# Altium project Camera.PrjPcb
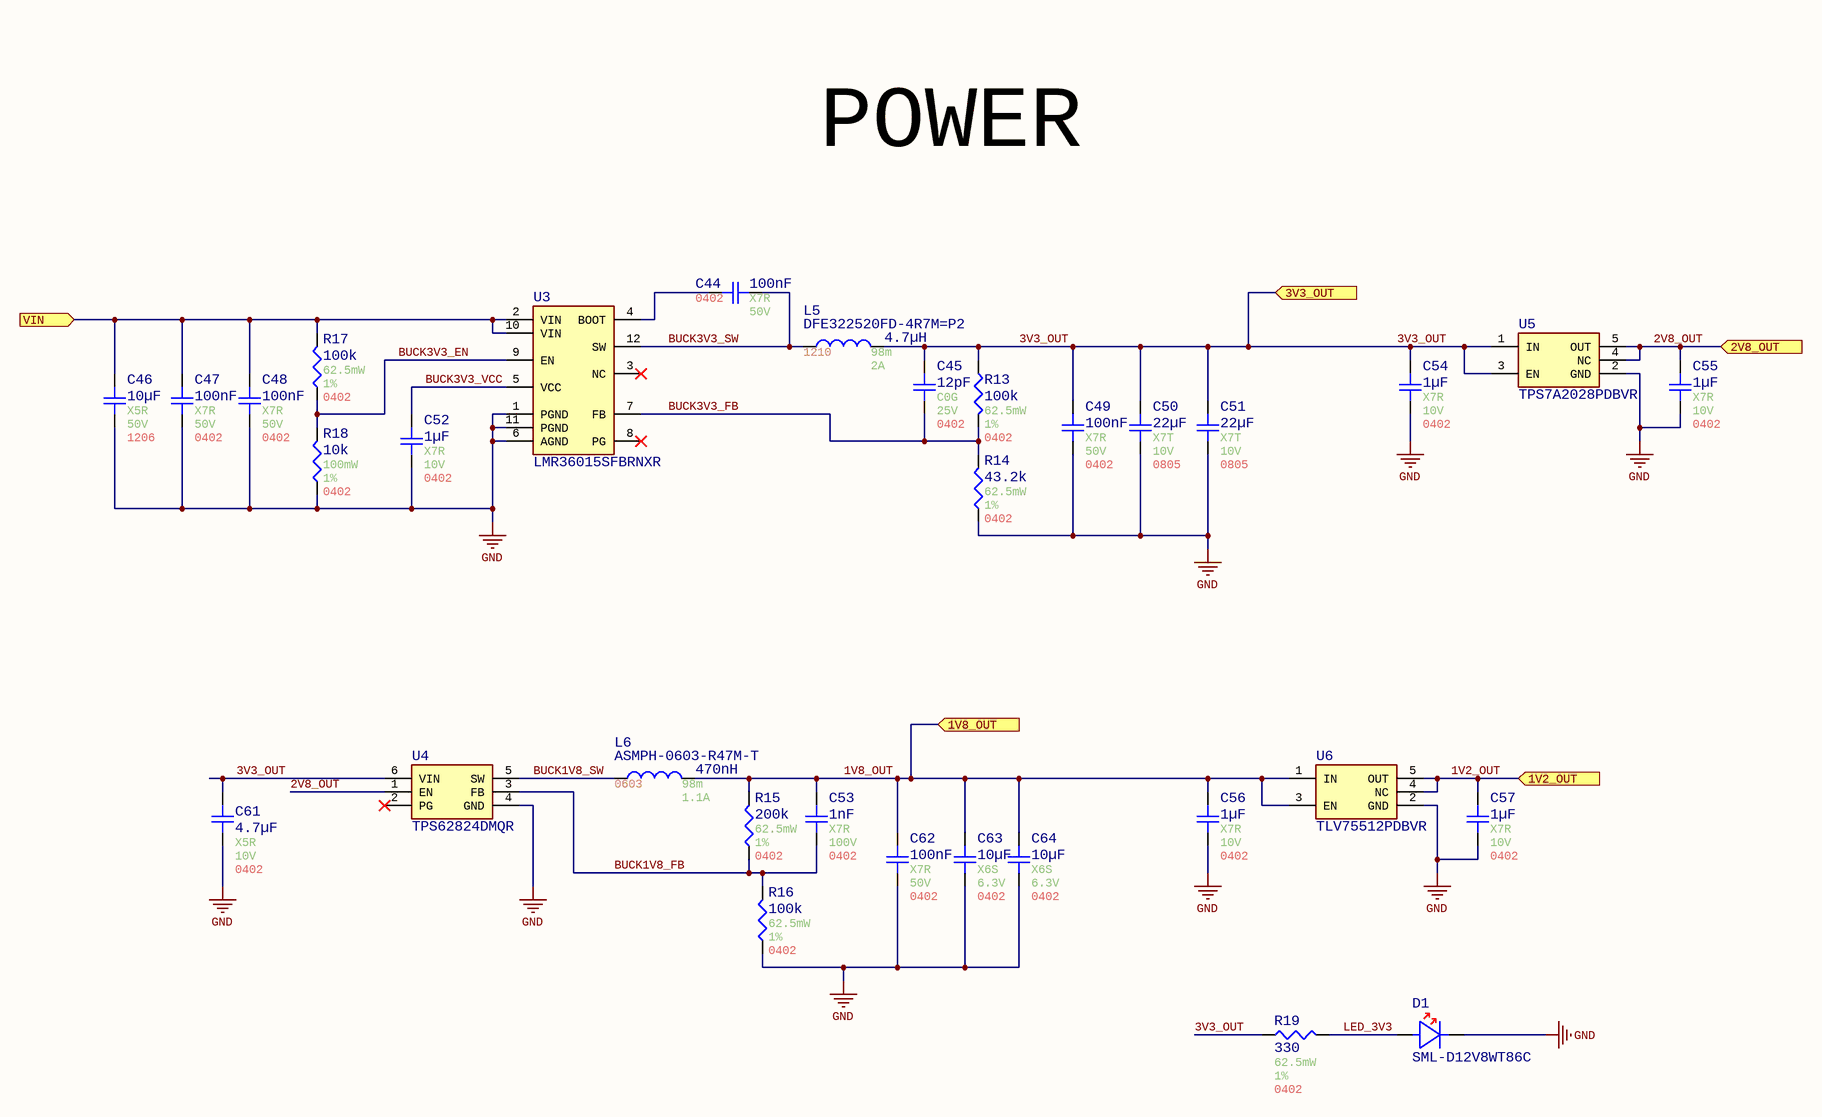
[diagram p0: Power.SchDoc]
PCBRevision: 0.0.1; ProjectTitle: Project; RR_PlaceNear: [{"paramVis":true,"a":{"refdes":"C6","srcUid":"OYVOCBFH","pin":"2"},"b":{"refdes":"U2","srcUid":"WNTCGATW","pin":"26"},"mm":5},{"paramVis":true,"a":{"refdes":"C7","srcUid":"CVMGOHLT","pin":"2"},"b":{"refdes":"U2","srcUid":"WNTCGATW","pin":"26"},"mm":5},{"paramVis":true,"a":{"refdes":"C8","srcUid":"TGPROSQA","pin":"2"},"b":{"refdes":"U2","srcUid":"WNTCGATW","pin":"26"},"mm":5},{"paramVis":true,"a":{"refdes":"C9","srcUid":"NERXMEEB","pin":"2"},"b":{"refdes":"U2","srcUid":"WNTCGATW","pin":"15"},"mm":5},{"paramVis":true,"a":{"refdes":"C10","srcUid":"PVQVEPHI","pin":"2"},"b":{"refdes":"U2","srcUid":"WNTCGATW","pin":"15"},"mm":5},{"paramVis":true,"a":{"refdes":"C11","srcUid":"IXZAQWUA","pin":"2"},"b":{"refdes":"U2","srcUid":"WNTCGATW","pin":"15"},"mm":5},{"paramVis":true,"a":{"refdes":"C12","srcUid":"SJIUUMFM","pin":"2"},"b":{"refdes":"U2","srcUid":"WNTCGATW","pin":"10"},"mm":5},{"paramVis":true,"a":{"refdes":"C13","srcUid":"VZIHORBA","pin":"2"},"b":{"refdes":"U2","srcUid":"WNTCGATW","pin":"10"},"mm":5},{"paramVis":true,"a":{"refdes":"C14","srcUid":"JKNMRYLV","pin":"2"},"b":{"refdes":"U2","srcUid":"WNTCGATW","pin":"10"},"mm":5},{"paramVis":true,"a":{"refdes":"C16","srcUid":"VAZDDXWB","pin":"2"},"b":{"refdes":"U2","srcUid":"WNTCGATW","pin":"25"},"mm":5},{"paramVis":true,"a":{"refdes":"C15","srcUid":"YTLVSWDQ","pin":"2"},"b":{"refdes":"U2","srcUid":"WNTCGATW","pin":"25"},"mm":5},{"paramVis":true,"a":{"refdes":"C18","srcUid":"XVSOHREA","pin":"2"},"b":{"refdes":"U2","srcUid":"WNTCGATW","pin":"16"},"mm":5},{"paramVis":true,"a":{"refdes":"C17","srcUid":"DALIXIOP","pin":"2"},"b":{"refdes":"U2","srcUid":"WNTCGATW","pin":"16"},"mm":5},{"paramVis":true,"a":{"refdes":"C20","srcUid":"WIZCYGLQ","pin":"2"},"b":{"refdes":"U2","srcUid":"WNTCGATW","pin":"11"},"mm":5},{"paramVis":true,"a":{"refdes":"C19","srcUid":"YZYSSQBB","pin":"2"},"b":{"refdes":"U2","srcUid":"WNTCGATW","pin":"11"},"mm":5},{"paramVis":true,"a":{"refdes":"C58","srcUid":"BEWWQTYO","pin":"1"},"b":{"refdes":"U2","srcUid":"WNTCGATW","pin":"9"},"mm":5},{"paramVis":true,"a":{"refdes":"C58","srcUid":"BEWWQTYO","pin":"2"},"b":{"refdes":"U2","srcUid":"WNTCGATW","pin":"11"},"mm":5}]; SchRevision: 0.1
2 sheets, 61 parts. Net scope: flat (ports and power ports of the same name join across sheets).
Board file: Camera.PcbDoc
Sheets:
  Power.SchDoc
  serializer.SchDoc

## Sheet Power.SchDoc: POWER
size 431 x 279 mm; SheetNumber: 3; SheetTotal: 4; SheetRevision: 1.0

### Parts
C44  value 100nF  Temperature Coefficient: X7R  Voltage Rating: 50V  Case/Package: 0402  [Generic 0402 capacitor]  (hidden comment: GRT155R71H104KE01D)
C45  value 12pF  Temperature Coefficient: C0G  Voltage Rating: 25V  Case/Package: 0402  [Generic 0402 capacitor]  (hidden comment: GRT1555C1E120JA02J)
C46  value 10µF  Temperature Coefficient: X5R  Voltage Rating: 50V  Case/Package: 1206  [Generic 1206 Capacitor]  (hidden comment: CL31A106MBHNNNE)
C47  value 100nF  Temperature Coefficient: X7R  Voltage Rating: 50V  Case/Package: 0402  [Generic 0402 capacitor]  (hidden comment: GRT155R71H104KE01D)
C48  value 100nF  Temperature Coefficient: X7R  Voltage Rating: 50V  Case/Package: 0402  [Generic 0402 capacitor]  (hidden comment: GRT155R71H104KE01D)
C49  value 100nF  Temperature Coefficient: X7R  Voltage Rating: 50V  Case/Package: 0402  [Generic 0402 capacitor]  (hidden comment: GRT155R71H104KE01D)
C50  value 22µF  Temperature Coefficient: X7T  Voltage Rating: 10V  Case/Package: 0805  [Generic 0805 Cap]  (hidden comment: GRT21BD71A226ME13L)
C51  value 22µF  Temperature Coefficient: X7T  Voltage Rating: 10V  Case/Package: 0805  [Generic 0805 Cap]  (hidden comment: GRT21BD71A226ME13L)
C52  value 1µF  Temperature Coefficient: X7R  Voltage Rating: 10V  Case/Package: 0402  [Generic 0402 capacitor]  (hidden comment: MAASL105CD7105MFCA01)
C53  value 1nF  Temperature Coefficient: X7R  Voltage Rating: 100V  Case/Package: 0402  [Generic 0402 capacitor]  (hidden comment: GCM155R72A102KA37J)
C54  value 1µF  Temperature Coefficient: X7R  Voltage Rating: 10V  Case/Package: 0402  [Generic 0402 capacitor]  (hidden comment: MAASL105CD7105MFCA01)
C55  value 1µF  Temperature Coefficient: X7R  Voltage Rating: 10V  Case/Package: 0402  [Generic 0402 capacitor]  (hidden comment: MAASL105CD7105MFCA01)
C56  value 1µF  Temperature Coefficient: X7R  Voltage Rating: 10V  Case/Package: 0402  [Generic 0402 capacitor]  (hidden comment: MAASL105CD7105MFCA01)
C57  value 1µF  Temperature Coefficient: X7R  Voltage Rating: 10V  Case/Package: 0402  [Generic 0402 capacitor]  (hidden comment: MAASL105CD7105MFCA01)
C61  value 4.7µF  Temperature Coefficient: X5R  Voltage Rating: 10V  Case/Package: 0402  [Generic 0402 capacitor]  (hidden comment: GRT155R61A475ME13D)
C62  value 100nF  Temperature Coefficient: X7R  Voltage Rating: 50V  Case/Package: 0402  [Generic 0402 capacitor]  (hidden comment: GRT155R71H104KE01D)
C63  value 10µF  Temperature Coefficient: X6S  Voltage Rating: 6.3V  Case/Package: 0402  [Generic 0402 capacitor]  (hidden comment: GRT155C80J106ME13J)
C64  value 10µF  Temperature Coefficient: X6S  Voltage Rating: 6.3V  Case/Package: 0402  [Generic 0402 capacitor]  (hidden comment: GRT155C80J106ME13J)
D1  SML-D12V8WT86C  [FP-SML-D12-MFG]
L5  DFE322520FD-4R7M=P2  value 4.7µH  DCR: 98m  Current Rating: 2A  Case/Package: 1210  [FP-DFE322520F_D-IPC_A]
L6  ASMPH-0603-R47M-T  value 470nH  DCR: 98m  Current Rating: 1.1A  Case/Package: 0603  [0603_1.6x0.8x0.8mm_IND]
R13  value 100k  Power: 62.5mW  Tolerance: 1%  Case/Package: 0402  [Generic 0402 Resistor]  (hidden comment: WR04X1003FTL)
R14  value 43.2k  Power: 62.5mW  Tolerance: 1%  Case/Package: 0402  [Generic 0402 Resistor]  (hidden comment: CR0402-FX-4322GLF)
R15  value 200k  Power: 62.5mW  Tolerance: 1%  Case/Package: 0402  [Generic 0402 Resistor]  (hidden comment: 560112110041)
R16  value 100k  Power: 62.5mW  Tolerance: 1%  Case/Package: 0402  [Generic 0402 Resistor]  (hidden comment: WR04X1003FTL)
R17  value 100k  Power: 62.5mW  Tolerance: 1%  Case/Package: 0402  [Generic 0402 Resistor]  (hidden comment: WR04X1003FTL)
R18  value 10k  Power: 100mW  Tolerance: 1%  Case/Package: 0402  [Generic 0402 Resistor]  (hidden comment: RNCP0402FTD10K0)
R19  value 330  Power: 62.5mW  Tolerance: 1%  Case/Package: 0402  [Generic 0402 Resistor]  (hidden comment: RMCF0402FT330R)
U3  LMR36015SFBRNXR  [VQFN_HR-12_3x2x1.0mm_P0.5mm]
U4  TPS62824DMQR  [VSON_HR-6_1.5x1.5x1.0mm_P0.5mm]
U5  TPS7A2028PDBVR  [SOT23-3_3x5x1.1mm_P0.95mm]
U6  TLV75512PDBVR  [SOT23-3_3x5x1.1mm_P0.95mm]

### Ports
1V2_OUT (in), 1V8_OUT (in), 2V8_OUT (in), 3V3_OUT (in), VIN (in)

### Nets
GND: C46.1 C47.2 C48.2 C49.2 C50.1 C51.1 C52.1 C54.1 C55.1 C56.1 C57.1 C61.2 C62.2 C63.1 C64.1 D1.1(C) R14.1 R16.1 R18.1 U3.1(PGND) U3.6(AGND) U3.11(PGND) U4.4(GND) U5.2(GND) U6.2(GND)
1V2_OUT: C57.2 U6.4(NC) U6.5(OUT) ; port 1V2_OUT
1V8_OUT: C53.2 C56.2 C62.1 C63.2 C64.2 L6.2 R15.2 U6.1(IN) U6.3(EN) ; port 1V8_OUT
2V8_OUT: C55.2 U4.1(EN) U5.4(NC) U5.5(OUT) ; port 2V8_OUT
3V3_OUT: C45.1 C49.1 C50.2 C51.2 C54.2 C61.1 L5.2 R13.1 R19.1 U4.6(VIN) U5.1(IN) U5.3(EN) ; port 3V3_OUT
BUCK1V8_FB: C53.1 R15.1 R16.2 U4.3(FB)
BUCK1V8_SW: L6.1 U4.5(SW)
BUCK3V3_EN: R17.1 R18.2 U3.9(EN)
BUCK3V3_FB: C45.2 R13.2 R14.2 U3.7(FB)
BUCK3V3_SW: C44.2 L5.1 U3.12(SW)
BUCK3V3_VCC: C52.2 U3.5(VCC)
LED_3V3: D1.2(A) R19.2
VIN: C46.2 C47.1 C48.1 R17.2 U3.2(VIN) U3.10(VIN) ; port VIN
NetC44_1: C44.1 U3.4(BOOT)

Not connected (* = marked no-connect by the designer): U3 3(NC)* 8(PG)*; U4 2(PG)*

### Notes on the sheet
- POWER
- Title:
- Author:
- Approved:
- Size:
- Date:
- Git Hash:
- Sch Revision:
- B
- Prj:
- Sheet Revision:
- Variant:
- Edited:
- CONFIDENTIAL
- File:

### Library data of the parts
C44 C47-C49 C62 = CMP-001-00084-12: Ceramic Capacitor, Multilayer, Ceramic, 50V, 10% +Tol, 10% -Tol, X7R, 15% TC, 0.1uF, Surface Mount, 0402; Multilayer: Yes; Terminal Finish: Nickel; Capacitor Type: Ceramic; Package Shape: Rectangular; Reach SVHC Compliant: Yes; Max Operating Temperature: 125°C; RoHS Compliant: Yes; Termination: Wraparound; Packaging: Tape and Reel; AECQ: Yes; Pins: 2; Dielectric Material: Ceramic; Min Operating Temperature: -55°C; Tolerance: 10%; Mounting Technology: Surface Mount
C45 = CMP-001-00109-2: Ceramic Capacitor, Multilayer, Ceramic, 25V, 5% +Tol, 5% -Tol, C0G, 30ppm/Cel TC, 0.000012uF, Surface Mount, 0402; AECQ: Yes; Pins: 2; RoHS Compliant: Yes; Max Operating Temperature: 125°C; Mounting Technology: Surface Mount; Capacitor Type: Ceramic; Min Operating Temperature: -55°C; Tolerance: 5%
C46 = CMP-001-00092-6: Ceramic Capacitor, Multilayer, Ceramic, 50V, 20% +Tol, 20% -Tol, X5R, 15% TC, 10uF, Surface Mount, 1206; AECQ: No; Multilayer: Yes; Reach SVHC Compliant: Yes; Package Shape: Rectangular; Temperature Characteristics Code: X5R; RoHS Compliant: Yes; Max Operating Temperature: 85°C; Mounting Technology: Surface Mount; Capacitor Type: Ceramic; Pins: 2; Packaging: Tape and Reel; Terminal Finish: Nickel; Tolerance: 20%; Termination: Wraparound; Dielectric Material: Ceramic; JESD-609 Code: e3; Min Operating Temperature: -55°C
C50 C51 = CMP-001-00095-2: 22 µF ±20% 10V Ceramic Capacitor X7T 0805 (2012 Metric); AECQ: Yes; Tolerance: 20%; Capacitor Type: Ceramic; Max Operating Temperature: 125°C; Pins: 2; Min Operating Temperature: -55°C; Mounting Technology: SMD
C52 C54-C57 = CMP-001-00104-2: Cap Cer 1UF 20V X7T 0402; AECQ: Yes; Capacitor Type: Ceramic; Tolerance: 20%; Min Operating Temperature: -55°C; Max Operating Temperature: 125°C; Pins: 2; RoHS Compliant: Yes; Mounting Technology: Surface Mount
C53 = CMP-001-00101-2: Ceramic Capacitor, Multilayer, Ceramic, 100V, 10% +Tol, 10% -Tol, X7R, 15% TC, 0.001uF, Surface Mount, 0402; AECQ: Yes; Min Operating Temperature: -55°C; Max Operating Temperature: 125°C; Pins: 2; Mounting Technology: SMD; Tolerance: 10%; Capacitor Type: Ceramic
C61 = CMP-001-00085-5: Ceramic Capacitor, Multilayer, Ceramic, 10V, 20% +Tol, 20% -Tol, X5R, 15% TC, 4.7uF, Surface Mount, 0402; Multilayer: Yes; Tolerance: 0%; Reach SVHC Compliant: Yes; Tolerance (fill in as +-): 20%; Packaging: Tape and Reel; Dielectric Material: Ceramic; Mounting Technology: Surface Mount; RoHS Compliant: Yes; Tolerance  (fill in as +-): 20%; Rated DC Voltage (URdc): 10V; Package Shape: Rectangular; Termination: Wraparound; Pins: 2; Max Operating Temperature: 85°C; Capacitor Type: Ceramic; Min Operating Temperature: -55°C; AECQ: Yes
C63 C64 = CMP-001-00108-2: Multilayer Ceramic Capacitors MLCC - SMD/SMT 0402 10uF 6.3VDC 20% X6S AEC-Q200; AECQ: Yes; Mounting Technology: Surface Mount; RoHS Compliant: Yes; Pins: 2; Min Operating Temperature: -55°C; Capacitor Type: Ceramic; Tolerance: 20%; Max Operating Temperature: 105°C
D1 = CMP-007-00036-1: Red 630nm LED Indication - Discrete 2.2V 0603 (1608 Metric); Case/Package: 0603; Forward Voltage: 2.2V; Colour: Red; Pins: 2
L5 = CMP-006-00022-5: General Purpose Inductor, 4.7uH, 20%, 1 Element, Metal Alloy-Core, SMD, 1210; AECQ: Yes; ComponentLink2Description: https://www.bourns.com/docs/Product-Datasheets/SRP4021HMCT.pdf; Min Operating Temperature: -40°C; Tolerance: 20%; Max Operating Temperature: 125°C; Pins: 2
L6 = CMP-006-00028-1: Inductor Power Shielded Multi-Layer 0.47uH 20% 1MHz Ferrite 1.1A 0.19Ohm DCR 0603 T/R; Self Resonant Frequency: 180MHz; AECQ: No; Shileded: Yes; Current - Saturation: 1.8A; Pins: 2; Max Operating Temperature: 125°C; Min Operating Temperature: -55°C; Tolerance: 20%; Height: 800µm; Mounting Technology: SMT
R13 R16 R17 = CMP-009-00188-7: Fixed Resistor, Metal Glaze/thick Film, 0.0625W, 100000ohm, 50V, 1% +/-Tol, 100ppm/Cel, Surface Mount, 0402; Manufacturer Part Number: Blank; Package Height: 0.35mm; AECQ: No; Temperature Coefficient (ppm/Cel): 100; Package Length: 1mm; Package Width: 0.5mm; Additional Feature: LASER TRIMMABLE; Rated Temperature: 70°C; Construction: Chip; RoHS Compliant: Yes; Resistor Type: FIXED RESISTOR; Min Operating Temperature: -55°C; Pins: 2; Technology: METAL GLAZE/THICK FILM; Reach SVHC Compliant: Yes; Working Voltage: 50V; JESD-609 Code: e3; Mounting Technology: Surface Mount; Max Operating Temperature: 155°C; Termination: Wraparound; Terminal Finish: Nickel; Packaging: Tape and Reel; Package Shape: Rectangular
R14 = CMP-009-00247-1: Fixed Resistor, Metal Glaze/Thick Film, 0.0625W, 43200ohm, 50V, 1% +/-Tol, Surface Mount, 0402; AECQ: No; Pins: 2; Mounting Technology: Surface Mount; Min Operating Temperature: -55°C; Max Operating Temperature: 155°C; RoHS Compliant: Yes; Voltage Rating: 50V
R15 = CMP-009-00248-1: Resistor, 200K, 0.1W, Thick Film, 0402;; AECQ: Yes; Voltage Rating: 50V; Pins: 2; Max Operating Temperature: 155°C; Mounting Technology: Surface Mount; Min Operating Temperature: -55°C; RoHS Compliant: Yes
R18 = CMP-009-00242-1: Fixed Resistor, Thin Film, 0.1W, 10000ohm, 50V, 1% +/-Tol, 100ppm/Cel, Surface Mount, 0402; Manufacturer Part Number: Blank; AECQ: Yes; Pins: 2; Max Operating Temperature: 155°C; Voltage Rating: 50V; Mounting Technology: SMD; Min Operating Temperature: -55°C
R19 = CMP-009-00225-1: Res Thick Film 0402 330 Ohm 1% 0.063W ±100ppm/°C Molded SMD Paper T/R; AECQ: Yes; Mounting Technology: Surface Mount; Max Operating Temperature: 155°C; RoHS Compliant: Yes; Pins: 2; Min Operating Temperature: -55°C
U3 = CMP-019-00065-1: IC REG BUCK ADJ 1.5A 12VQFN Buck Switching Regulator IC Positive Adjustable 1V 1 Output 1.5A 12-VFQFN; Frequency: 1.7MHz; Max Supply Voltage: 17V; Output Current: 1A; Output Voltage: 3.3V; Min Supply Voltage: 3V; Case/Package: 12-VQFN (3x2); Pins: 12; RoHS Compliant: Yes; Min Operating Temperature: -40°C; Mounting Technology: SMD; Max Operating Temperature: 125°C
U4 = CMP-019-00068-1: IC REG BUCK ADJ 1A 6VSON Buck Switching Regulator IC Positive Adjustable 0.6V 1 Output 1A 6-VFDFN; Min Supply Voltage: 2.4V; Max Supply Voltage: 5.5V; Frequency: 2.2MHz; Output Current: 1A; Case/Package: 6-VSON-HR (1.5x1.5); Pins: 6; Min Operating Temperature: -40°C; RoHS Compliant: Yes; Max Operating Temperature: 125°C; Mounting Technology: SMD
U5 = CMP-019-00066-2: 300mA ultra-low-noise low-IQ low-dropout (LDO) linear regulator with high PSRR 5-SOT-23 -40 to 125; Min Supply Voltage: 3.1V; Dropout Voltage: 145mV; Output Voltage: 2.8V; Frequency: 1.7MHz; Max Supply Voltage: 6V; Min Operating Temperature: -40°C; Mounting Technology: SMD; Case/Package: SOT-23; Pins: 5; Output Current: 300mA; RoHS Compliant: Yes; Max Operating Temperature: 125°C
U6 = CMP-019-00067-2: 500mA high-PSRR low-IQ low-dropout voltage regulator with enable 5-SOT-23 -40 to 125; Max Supply Voltage: 5.5V; Nominal Supply Current: 25µA; Dropout Voltage: 238mV; Min Supply Voltage: 1.45V; Frequency: 1.7MHz; Output Voltage: 1.2V; Min Operating Temperature: -40°C; Case/Package: SOT-23; RoHS Compliant: Yes; Max Operating Temperature: 125°C; Output Current: 500mA; Mounting Technology: SMD; Pins: 5

## Sheet serializer.SchDoc: SERIALIZER
size 431 x 279 mm; SheetNumber: 4; SheetTotal: 4; SheetRevision: 1.0
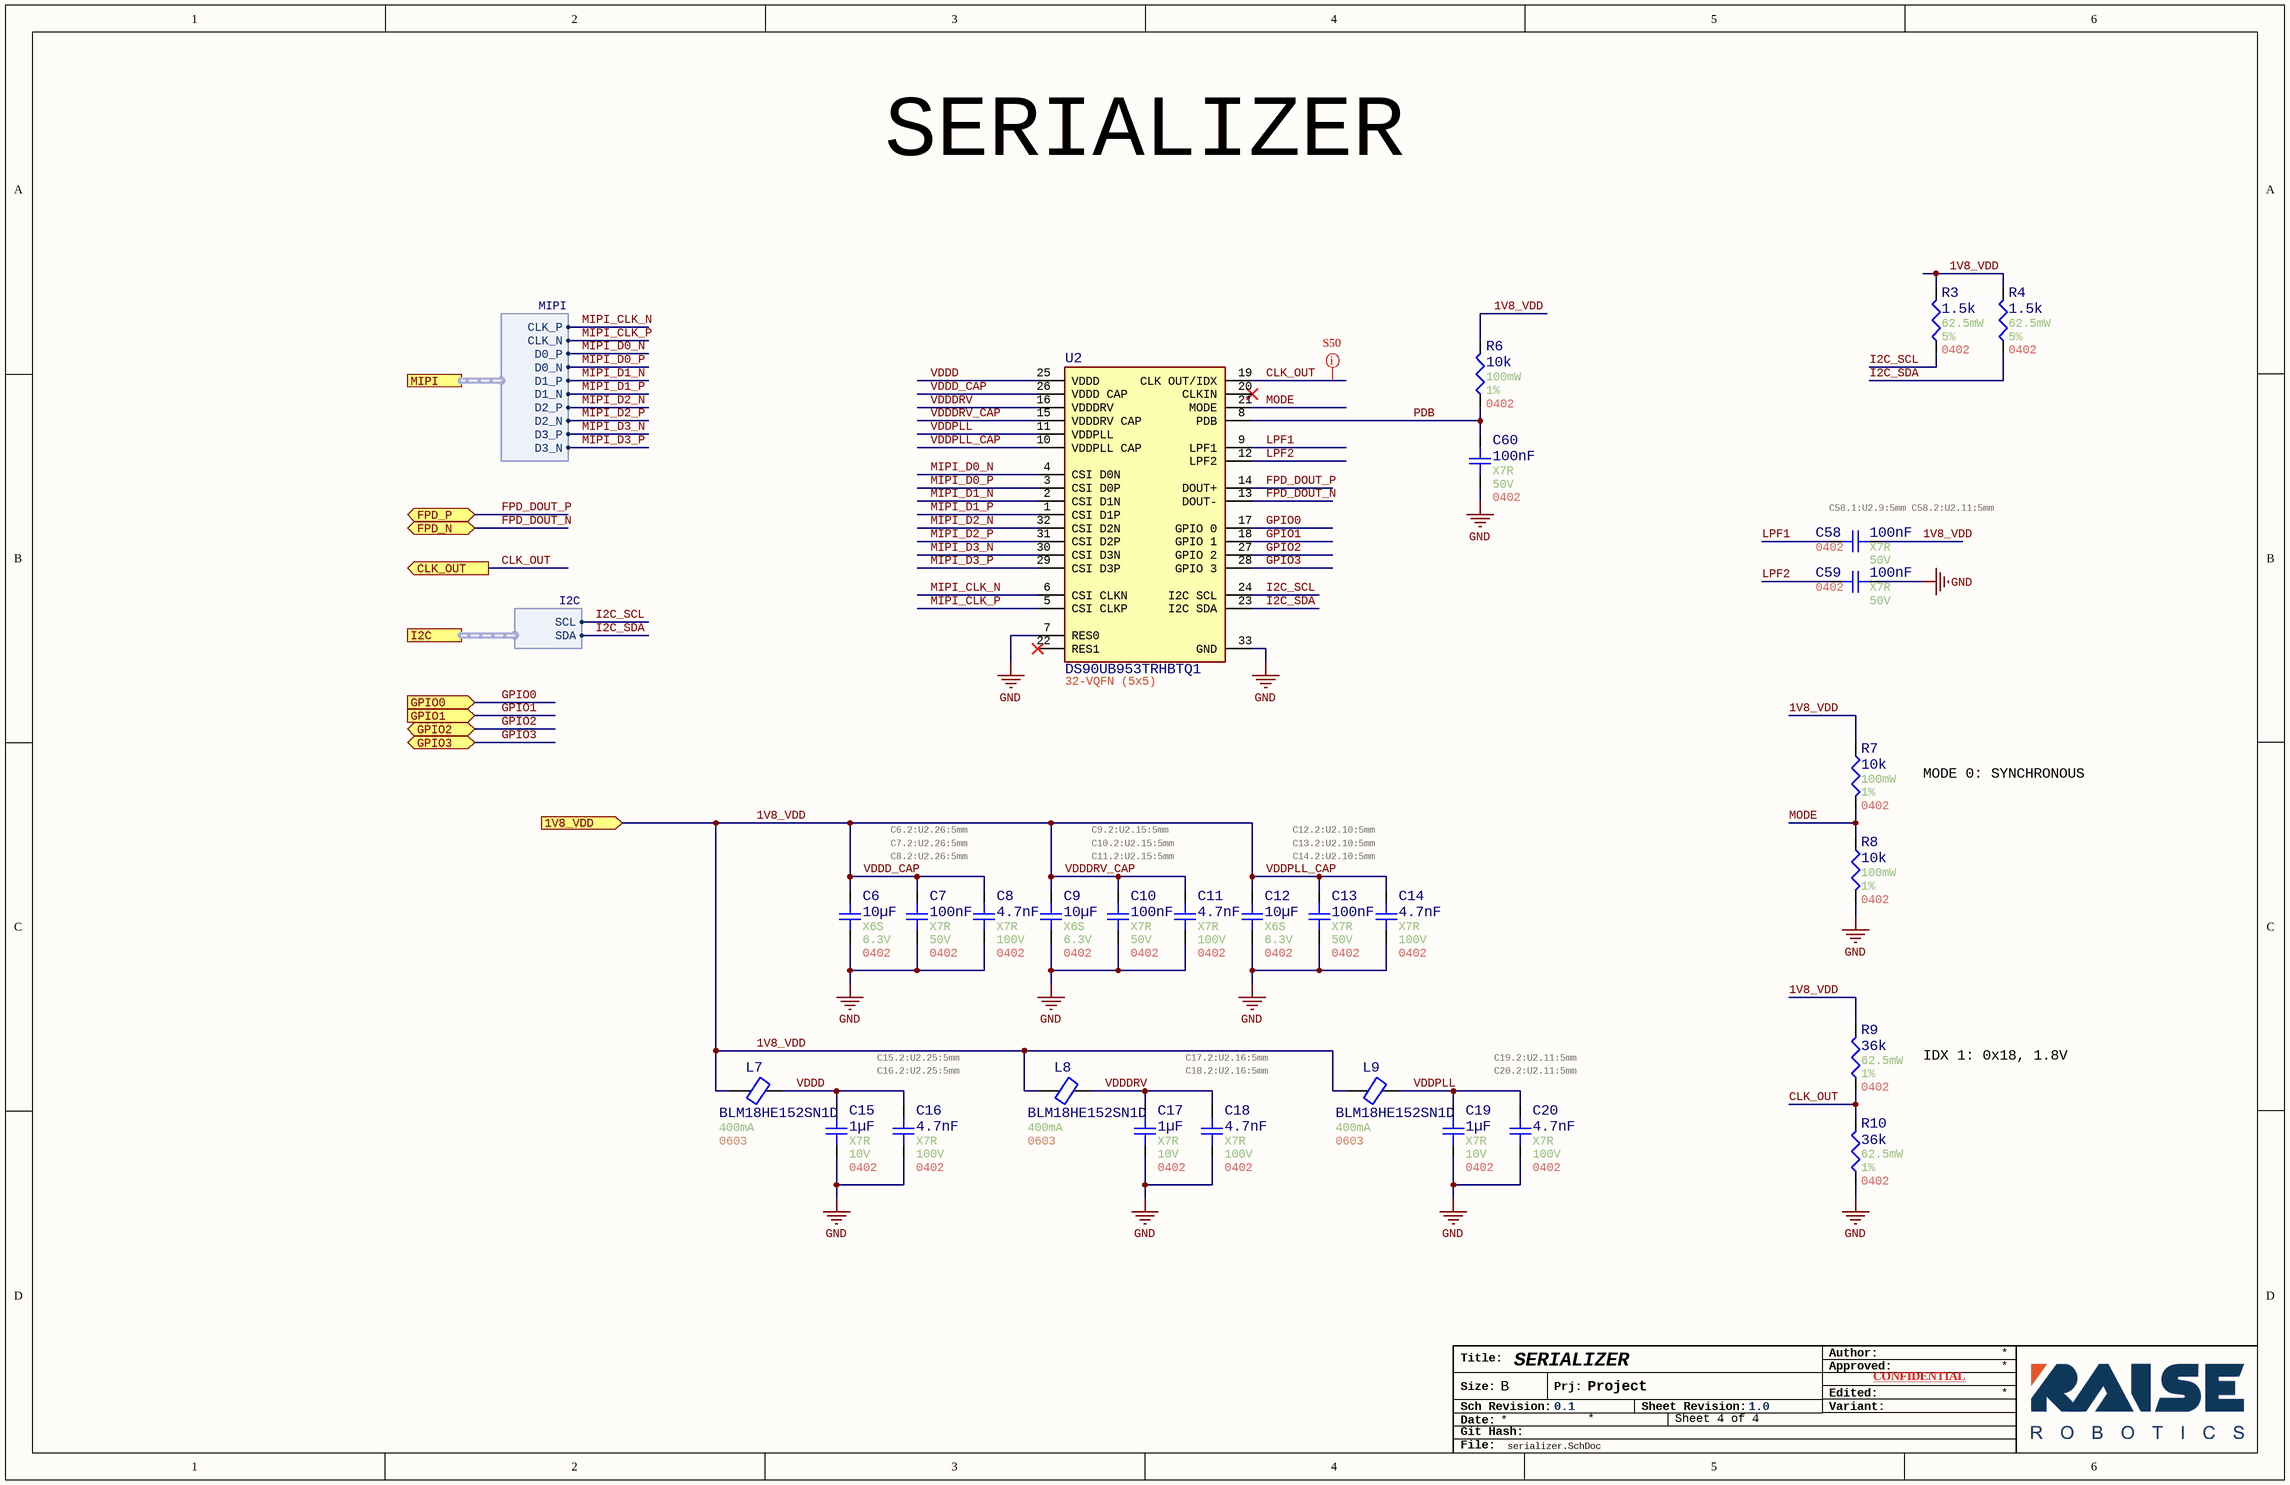
[diagram p1: serializer.SchDoc]

### Parts
C6  value 10µF  Temperature Coefficient: X6S  Voltage Rating: 6.3V  Case/Package: 0402  PlaceNear: C6.2:U2.26:5mm  [Generic 0402 capacitor]  (hidden comment: GRT155C80J106ME13J)
C7  value 100nF  Temperature Coefficient: X7R  Voltage Rating: 50V  Case/Package: 0402  PlaceNear: C7.2:U2.26:5mm  [Generic 0402 capacitor]  (hidden comment: GRT155R71H104KE01D)
C8  value 4.7nF  Temperature Coefficient: X7R  Voltage Rating: 100V  Case/Package: 0402  PlaceNear: C8.2:U2.26:5mm  [Generic 0402 capacitor]  (hidden comment: GCM155R72A472KA37D)
C9  value 10µF  Temperature Coefficient: X6S  Voltage Rating: 6.3V  Case/Package: 0402  PlaceNear: C9.2:U2.15:5mm  [Generic 0402 capacitor]  (hidden comment: GRT155C80J106ME13J)
C10  value 100nF  Temperature Coefficient: X7R  Voltage Rating: 50V  Case/Package: 0402  PlaceNear: C10.2:U2.15:5mm  [Generic 0402 capacitor]  (hidden comment: GRT155R71H104KE01D)
C11  value 4.7nF  Temperature Coefficient: X7R  Voltage Rating: 100V  Case/Package: 0402  PlaceNear: C11.2:U2.15:5mm  [Generic 0402 capacitor]  (hidden comment: GCM155R72A472KA37D)
C12  value 10µF  Temperature Coefficient: X6S  Voltage Rating: 6.3V  Case/Package: 0402  PlaceNear: C12.2:U2.10:5mm  [Generic 0402 capacitor]  (hidden comment: GRT155C80J106ME13J)
C13  value 100nF  Temperature Coefficient: X7R  Voltage Rating: 50V  Case/Package: 0402  PlaceNear: C13.2:U2.10:5mm  [Generic 0402 capacitor]  (hidden comment: GRT155R71H104KE01D)
C14  value 4.7nF  Temperature Coefficient: X7R  Voltage Rating: 100V  Case/Package: 0402  PlaceNear: C14.2:U2.10:5mm  [Generic 0402 capacitor]  (hidden comment: GCM155R72A472KA37D)
C15  value 1µF  Temperature Coefficient: X7R  Voltage Rating: 10V  Case/Package: 0402  PlaceNear: C15.2:U2.25:5mm  [Generic 0402 capacitor]  (hidden comment: MAASL105CD7105MFCA01)
C16  value 4.7nF  Temperature Coefficient: X7R  Voltage Rating: 100V  Case/Package: 0402  PlaceNear: C16.2:U2.25:5mm  [Generic 0402 capacitor]  (hidden comment: GCM155R72A472KA37D)
C17  value 1µF  Temperature Coefficient: X7R  Voltage Rating: 10V  Case/Package: 0402  PlaceNear: C17.2:U2.16:5mm  [Generic 0402 capacitor]  (hidden comment: MAASL105CD7105MFCA01)
C18  value 4.7nF  Temperature Coefficient: X7R  Voltage Rating: 100V  Case/Package: 0402  PlaceNear: C18.2:U2.16:5mm  [Generic 0402 capacitor]  (hidden comment: GCM155R72A472KA37D)
C19  value 1µF  Temperature Coefficient: X7R  Voltage Rating: 10V  Case/Package: 0402  PlaceNear: C19.2:U2.11:5mm  [Generic 0402 capacitor]  (hidden comment: MAASL105CD7105MFCA01)
C20  value 4.7nF  Temperature Coefficient: X7R  Voltage Rating: 100V  Case/Package: 0402  PlaceNear: C20.2:U2.11:5mm  [Generic 0402 capacitor]  (hidden comment: GCM155R72A472KA37D)
C58  value 100nF  Temperature Coefficient: X7R  Voltage Rating: 50V  Case/Package: 0402  PlaceNear: C58.1:U2.9:5mm / C58.2:U2.11:5mm  [Generic 0402 capacitor]  (hidden comment: GRT155R71H104KE01D)
C59  value 100nF  Temperature Coefficient: X7R  Voltage Rating: 50V  Case/Package: 0402  [Generic 0402 capacitor]  (hidden comment: GRT155R71H104KE01D)
C60  value 100nF  Temperature Coefficient: X7R  Voltage Rating: 50V  Case/Package: 0402  [Generic 0402 capacitor]  (hidden comment: GRT155R71H104KE01D)
L7  BLM18HE152SN1D  Current Rating: 400mA  Case/Package: 0603  [0603_1.6x0.8x0.8mm_IND]
L8  BLM18HE152SN1D  Current Rating: 400mA  Case/Package: 0603  [0603_1.6x0.8x0.8mm_IND]
L9  BLM18HE152SN1D  Current Rating: 400mA  Case/Package: 0603  [0603_1.6x0.8x0.8mm_IND]
R3  value 1.5k  Power: 62.5mW  Tolerance: 5%  Case/Package: 0402  [Generic 0402 Resistor]  (hidden comment: RMCF0402JT1K50)
R4  value 1.5k  Power: 62.5mW  Tolerance: 5%  Case/Package: 0402  [Generic 0402 Resistor]  (hidden comment: RMCF0402JT1K50)
R6  value 10k  Power: 100mW  Tolerance: 1%  Case/Package: 0402  [Generic 0402 Resistor]  (hidden comment: RNCP0402FTD10K0)
R7  value 10k  Power: 100mW  Tolerance: 1%  Case/Package: 0402  [Generic 0402 Resistor]  (hidden comment: RNCP0402FTD10K0)
R8  value 10k  Power: 100mW  Tolerance: 1%  Case/Package: 0402  [Generic 0402 Resistor]  (hidden comment: RNCP0402FTD10K0)
R9  value 36k  Power: 62.5mW  Tolerance: 1%  Case/Package: 0402  [Generic 0402 Resistor]  (hidden comment: AC0402FR-0736KL)
R10  value 36k  Power: 62.5mW  Tolerance: 1%  Case/Package: 0402  [Generic 0402 Resistor]  (hidden comment: AC0402FR-0736KL)
U2  DS90UB953TRHBTQ1  Case/Package: 32-VQFN (5x5)  [VQFN-32_5x5x1.0mm_P0.5mm]

### Ports
1V8_VDD (in), CLK_OUT (out), FPD_N (bidir), FPD_P (bidir), GPIO0 (in), GPIO1 (in), GPIO2 (bidir), GPIO3 (bidir), I2C (harness I2C), MIPI (harness MIPI)

### Harnesses
MIPI: CLK_P, CLK_N, D0_P, D0_N, D1_P, D1_N, D2_P, D2_N, D3_P, D3_N
I2C: SCL, SDA

### Nets
GND: C6.1 C7.1 C8.1 C9.1 C10.1 C11.1 C12.1 C13.1 C14.1 C15.1 C16.1 C17.1 C18.1 C19.1 C20.1 C59.2 C60.2 R8.2 R10.1 U2.7(RES0) U2.33(GND)
1V8_VDD: C6.2 C7.2 C8.2 C9.2 C10.2 C11.2 C12.2 C13.2 C14.2 C58.2 L7.1 L8.1 L9.1 R3.2 R4.2 R6.2 R7.1 R9.2 U2.10(VDDPLL_CAP) U2.15(VDDDRV_CAP) U2.26(VDDD_CAP) ; port 1V8_VDD  [also labelled VDDD_CAP, VDDDRV_CAP, VDDPLL_CAP]
CLK_OUT: R9.1 R10.2 U2.19(CLK_OUT/IDX) ; port CLK_OUT
FPD_DOUT_N: U2.13(DOUT-) ; port FPD_N
FPD_DOUT_P: U2.14(DOUT+) ; port FPD_P
GPIO0: U2.17(GPIO_0) ; port GPIO0
GPIO1: U2.18(GPIO_1) ; port GPIO1
GPIO2: U2.27(GPIO_2) ; port GPIO2
GPIO3: U2.28(GPIO_3) ; port GPIO3
I2C_SCL: R3.1 U2.24(I2C_SCL) ; port I2C.SCL
I2C_SDA: R4.1 U2.23(I2C_SDA) ; port I2C.SDA
LPF1: C58.1 U2.9(LPF1)
LPF2: C59.1 U2.12(LPF2)
MIPI_CLK_N: U2.6(CSI_CLKN) ; port MIPI.CLK_P
MIPI_CLK_P: U2.5(CSI_CLKP) ; port MIPI.CLK_N
MIPI_D0_N: U2.4(CSI_D0N) ; port MIPI.D0_P
MIPI_D0_P: U2.3(CSI_D0P) ; port MIPI.D0_N
MIPI_D1_N: U2.2(CSI_D1N) ; port MIPI.D1_P
MIPI_D1_P: U2.1(CSI_D1P) ; port MIPI.D1_N
MIPI_D2_N: U2.32(CSI_D2N) ; port MIPI.D2_P
MIPI_D2_P: U2.31(CSI_D2P) ; port MIPI.D2_N
MIPI_D3_N: U2.30(CSI_D3N) ; port MIPI.D3_P
MIPI_D3_P: U2.29(CSI_D3P) ; port MIPI.D3_N
MODE: R7.2 R8.1 U2.21(MODE)
PDB: C60.1 R6.1 U2.8(PDB)
VDDD: C15.2 C16.2 L7.2 U2.25(VDDD)
VDDDRV: C17.2 C18.2 L8.2 U2.16(VDDDRV)
VDDPLL: C19.2 C20.2 L9.2 U2.11(VDDPLL)

Not connected (* = marked no-connect by the designer): U2 20(CLKIN)* 22(RES1)*

### Layout directives
net class S50: CLK_OUT

### Notes on the sheet
- SERIALIZER
- MODE 0: SYNCHRONOUS
- IDX 1: 0x18, 1.8V
- Title:
- Author:
- Approved:
- Size:
- Date:
- Git Hash:
- Sch Revision:
- B
- Prj:
- Sheet Revision:
- Variant:
- Edited:
- CONFIDENTIAL
- File:

### Library data of the parts
C6 C9 C12 = CMP-001-00108-2: as C63 on sheet Power; Mounting Technology: Surface Mount; RoHS Compliant: Yes; Pins: 2; Min Operating Temperature: -55°C; Capacitor Type: Ceramic; Tolerance: 20%; Max Operating Temperature: 105°C
C7 C10 C13 C58-C60 = CMP-001-00084-12: as C44 on sheet Power; Terminal Finish: Nickel; Capacitor Type: Ceramic; Package Shape: Rectangular; Reach SVHC Compliant: Yes; Max Operating Temperature: 125°C; RoHS Compliant: Yes; Termination: Wraparound; Packaging: Tape and Reel; AECQ: Yes; Pins: 2; Dielectric Material: Ceramic; Min Operating Temperature: -55°C; Tolerance: 10%; Mounting Technology: Surface Mount
C8 C11 C14 C16 C18 C20 = CMP-001-00110-2: Ceramic Capacitor, Multilayer, Ceramic, 100V, 10% +Tol, 10% -Tol, X7R, 15% TC, 0.0047uF, Surface Mount, 0402; AECQ: Yes; Min Operating Temperature: -55°C; Mounting Technology: SMD; Capacitor Type: Ceramic; Max Operating Temperature: 125°C; Tolerance: 10%; RoHS Compliant: Yes; Pins: 2
C15 C17 C19 = CMP-001-00104-2: as C52 on sheet Power; Min Operating Temperature: -55°C; Max Operating Temperature: 125°C; Pins: 2; RoHS Compliant: Yes; Mounting Technology: Surface Mount
L7-L9 = CMP-006-00026-1: Ferrite Beads Multi-Layer 1.5KOhm 25% 100MHz 500mA 500mOhm DCR 0603 T/R; Current - Saturation: 13.3A; AECQ: no; DCR: 20.5m; Shileded: Yes; Height: 800µm; Max Operating Temperature: 125°C; Pins: 2; Tolerance: 25%; Min Operating Temperature: -55°C
R3 R4 = CMP-009-00226-1: Res Thick Film 0402 1.5K Ohm 5% 0.063W ±100ppm/°C Molded SMD Paper T/R; AECQ: Yes; Pins: 2; Mounting Technology: Surface Mount; RoHS Compliant: Yes; Max Operating Temperature: 155°C; Min Operating Temperature: -55°C
R6-R8 = CMP-009-00242-1: as R18 on sheet Power; Pins: 2; Max Operating Temperature: 155°C; Voltage Rating: 50V; Mounting Technology: SMD; Min Operating Temperature: -55°C
R9 R10 = CMP-009-00198-3: Fixed Resistor, Metal Glaze/thick Film, 0.0625W, 36000ohm, 50V, 1% +/-Tol, 100ppm/Cel, Surface Mount, 0402; AECQ: Yes; Pins: 2; Mounting Technology: SMD; Min Operating Temperature: -55°C; Max Operating Temperature: 155°C
U2 = CMP-010-00047-1: 2 MP MIPI® CSI-2 FPD-Link III serializer for 2MP/60fps cameras & radar 32-VQFN -40 to 105; Nominal Supply Current: 370µA; Output Current: 6A; Max Supply Voltage: 3.6V; Sensor Type: Current shunt amp; Min Supply Voltage: 800mV; Nominal Supply Voltage: 5.7V; Pins: 32; Max Operating Temperature: 105°C; Min Operating Temperature: -40°C; Mounting Technology: SMD

## Nets that join several sheets
GND: Power (25 pins), serializer (21 pins)

## Assembly variants
Main: not fitted R7 R9